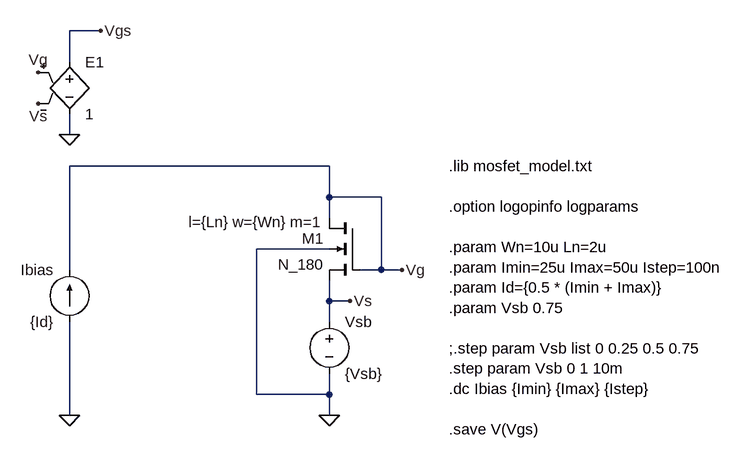
[diagram p0: schematic nmos_single.asc]
nmos_single.asc, the LTspice schematic file:
Version 4.1
SHEET 1 1024 680
WIRE 0 -224 -48 -224
WIRE -48 -176 -48 -224
WIRE -48 -64 -48 -96
WIRE 352 -16 -48 -16
WIRE 352 32 352 -16
WIRE 432 32 352 32
WIRE 352 64 352 32
WIRE 352 112 240 112
WIRE -48 144 -48 -16
WIRE 432 144 432 32
WIRE 432 144 400 144
WIRE 464 144 432 144
WIRE 352 192 352 160
WIRE 384 192 352 192
WIRE 352 224 352 192
WIRE 240 336 240 112
WIRE 352 336 352 304
WIRE 352 336 240 336
WIRE -48 368 -48 224
WIRE 352 368 352 336
FLAG -48 368 0
FLAG 352 368 0
FLAG 464 144 Vg
FLAG 384 192 Vs
FLAG -48 -64 0
FLAG -96 -112 Vs
FLAG -96 -160 Vg
FLAG 0 -224 Vgs
SYMBOL current -48 224 R180
WINDOW 0 24 80 Left 2
WINDOW 3 24 0 Left 2
SYMATTR InstName Ibias
SYMATTR Value {Id}
SYMBOL nmos4 400 64 M0
WINDOW 123 56 6 Left 2
SYMATTR Value2 l={Ln} w={Wn} m=1
SYMATTR InstName M1
SYMATTR Value N_180
SYMBOL voltage 352 208 R0
SYMATTR InstName Vsb
SYMATTR Value {Vsb}
SYMBOL e -48 -192 R0
SYMATTR InstName E1
SYMATTR Value 1
TEXT 536 -16 Left 2 !.lib mosfet_model.txt\n \n.option logopinfo logparams\n \n.param Wn=10u Ln=2u \n.param Imin=25u Imax=50u Istep=100n\n.param Id={0.5 * (Imin + Imax)}\n.param Vsb 0.75\n \n;.step param Vsb list 0 0.25 0.5 0.75\n.step param Vsb 0 1 10m\n.dc Ibias {Imin} {Imax} {Istep}\n \n.save V(Vgs)

The netlist it stands for:
* nmos_single.asc
Ibias 0 Vg {Id}
M1 Vg Vg Vs 0 N_180 l={Ln} w={Wn} m=1
Vsb Vs 0 {Vsb}
E1 Vgs 0 Vg Vs 1
.model NMOS NMOS
.model PMOS PMOS
.lib standard.mos
.lib mosfet_model.txt
.option logopinfo logparams
.param Wn=10u Ln=2u
.param Imin=25u Imax=50u Istep=100n
.param Id={0.5 * (Imin + Imax)}
.param Vsb 0.75
;.step param Vsb list 0 0.25 0.5 0.75
.step param Vsb 0 1 10m
.dc Ibias {Imin} {Imax} {Istep}
.save V(Vgs)
.backanno
.end